# Altium schematic sheet Isolated Power.SchDoc
size A
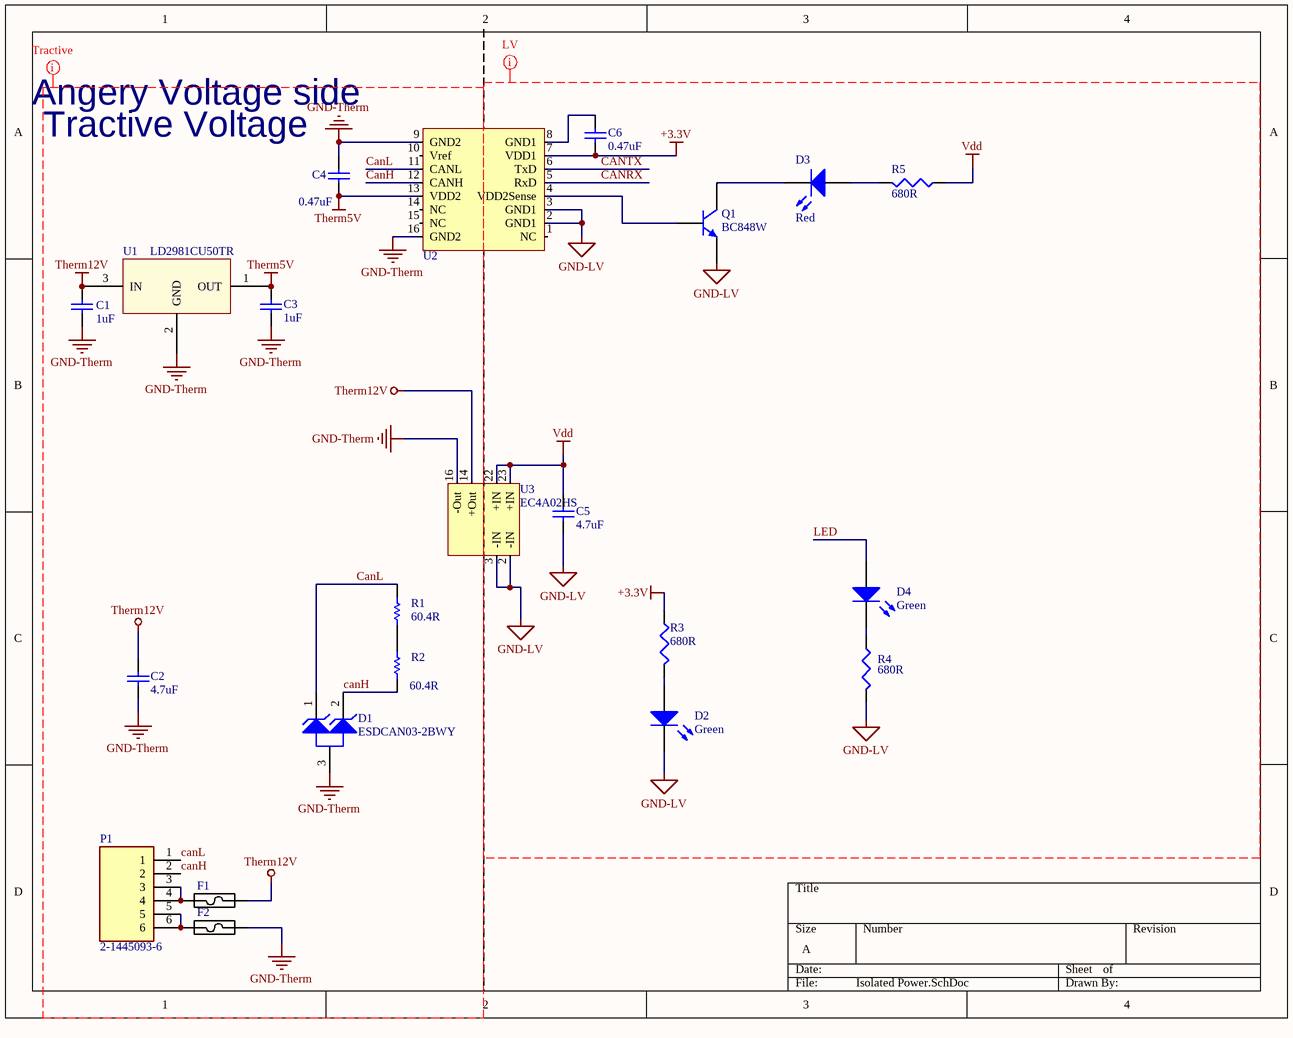
[diagram p0: Isolated Power.SchDoc]

## Parts
C1  value 1uF  [CAPC1608X95N]  (hidden comment: Cap)
C2  value 4.7uF  [CAPC1608X95N]  (hidden comment: Cap)
C3  value 1uF  [CAPC1608X95N]  (hidden comment: NP0)
C4  value 0.47uF  [CAPC1608X95N]  (hidden comment: NP0)
C5  value 4.7uF  [CAPC1608X95N]  (hidden comment: Cap)
C6  value 0.47uF  [CAPC1608X95N]  (hidden comment: NP0)
D1  ESDCAN03-2BWY  [SOT65P210X110-3N]
D2  Green  [0805_A]
D3  Red  [0805_A]
D4  Green  [0805_A]
F1  FUSE-GENERIC  [HF461 Fuse]  (value not drawn)
F2  FUSE-GENERIC  [HF461 Fuse]  (value not drawn)
P1  2-1445093-6  [214450936]
Q1  BC848W  [SOT323_N]
R1  value 60.4R  [RESC1608X55N]  (hidden comment: Res1)
R2  value 60.4R  [RESC1608X55N]  (hidden comment: Res1)
R3  value 680R  [RESC1608X55N]  (hidden comment: Res3)
R4  680R  [RESC1608X55N]
R5  value 680R  [RESC1608X55N]  (hidden comment: Res3)
U1  LD2981CU50TR  [SOT89N]
U2  ADM3054  [SOIC-OE16_L]  (value not drawn)
U3  EC4A02HS  [EC4A]

## Nets
+3.3V: C6.1 R3.1 U2.7(VDD1)
GND-LV: C5.2 D2.1(K) Q1.2(E) R4.2 U2.2(GND1) U2.3(GND1) U3.2(-IN) U3.3(-IN)
GND-Therm: C1.1 C2.2 C3.2 C4.2 D1.3(A) F2.2 U1.2(GND) U2.9(GND2) U2.16(GND2) U3.16(-Out)
Therm5V: C3.1 C4.1 U1.1(OUT) U2.13(VDD2)
Therm12V: C1.2 C2.1 F1.2 U1.3(IN) U3.14(+Out)
Vdd: C5.1 R5.1 U3.22(+IN) U3.23(+IN)
canH: D1.2(K2) P1.2 R2.1 U2.12(CANH)
CanL: D1.1(K1) P1.1 R1.2 U2.11(CANL)
CANRX: U2.5(RxD)
CANTX: U2.6(TxD)
LED: D4.2(A)
NetC6_2: C6.2 U2.8(GND1)
NetD2_2: D2.2(A) R3.2
NetD3_1: D3.1(K) Q1.3(C)
NetD3_2: D3.2(A) R5.2
NetD4_1: D4.1(K) R4.1
NetF1_1: F1.1 P1.3 P1.4
NetF2_1: F2.1 P1.5 P1.6
NetQ1_1: Q1.1(B) U2.4(VDD2Sense)
NetR1_1: R1.1 R2.2

Not connected (* = marked no-connect by the designer): U2 1(NC) 10(Vref) 14(NC) 15(NC)

## Layout directives
net class Tractive: CanH, canH, canL, CanL, GND-Therm, Therm5V, Therm12V
net class LV: +3.3V, CANRX, CANTX, GND-LV, LED, Vdd

## Notes on the sheet
- Angery Voltage side
- (near C4) Tractive Voltage

## Library data of the parts
C1 = Cap: 264-4630; Published: 8-Jun-2000; LatestRevisionDate: 17-Jul-2002; LatestRevisionNote: Re-released for DXP Platform.; PackageReference: RAD-0.3; Publisher: Altium Limited; PackageDescription: Radial Cap, Thru-Hole; 2 Leads; 0.3 in Pin Spacing
C2 C5 = Cap: 691-1228; Published: 8-Jun-2000; LatestRevisionDate: 17-Jul-2002; LatestRevisionNote: Re-released for DXP Platform.; PackageReference: RAD-0.3; Publisher: Altium Limited; PackageDescription: Radial Cap, Thru-Hole; 2 Leads; 0.3 in Pin Spacing
C3 C4 C6 = Cap: 884-7175; Published: 8-Jun-2000; LatestRevisionDate: 17-Jul-2002; LatestRevisionNote: Re-released for DXP Platform.; PackageReference: RAD-0.3; Publisher: Altium Limited; PackageDescription: Radial Cap, Thru-Hole; 2 Leads; 0.3 in Pin Spacing
D1 = NZL5V6ATT1: 124-1110; Manufacturer: On Semiconductor; Direction: Unidirectional; IR Max (uA): 1; Packing: Tape and Reel; V(BR) Typ (V): 5.6; DatasheetVersion: Rev. 3; PackageVersion: Rev. F, 07/2005; PackageReference: SC-75-3-463-01; PackageDescription: 3-Pin Small Outline Transistor, Body 1.6 x 0.8 mm, Pitch 0.5 mm; Supplier 1: Digi-Key; Supplier Part Number 1: NZL5V6ATT1OS-ND; Mounting Technology: Surface Mount; PartNumber: NZL5V6ATT1; ComponentLink1Description: Manufacturer URL; ComponentLink1URL: http://www.onsemi.com/; ComponentLink2Description: Datasheet; ComponentLink2URL: http://www.onsemi.com/pub_link/Collateral/NZL5V6ATT1-D.PDF; ComponentLink3Description: Package Specification; ComponentLink3URL: http://www.onsemi.com/pub_link/Collateral/463-01.PDF
D2-D4 = CMP-1426-00010-1: SMD mono-color Chip LED, WL-SMCW, Super Red; Manufacturer: Wuerth Elektronik; PartNumber: 150080SS75000; PackageReference: 0805_A; ComponentLink2URL: http://katalog.we-online.com/led/datasheet/150080SS75000.pdf; ComponentLink1URL: http://www.we-online.com; Color: Super Red; ComponentLink2Description: Datasheet; ComponentLink1Description: Manufacturer URL
F1 F2 = FUSE-GENERIC: 738-2970 / 0461.500ER
P1 = 2-1445093-6: Connector; Manufacturer_Name: TE Connectivity; Datasheet Link: https://www.te.com/commerce/DocumentDelivery/DDEController?Action=srchrtrv&DocNm=1445093&DocType=Customer+Drawing&DocLang=English; Height: 9.24mm; Manufacturer_Part_Number: 2-1445093-6
Q1 = BC848W: NPN General-purpose Transistor; Published: 17-Sep-2003; LatestRevisionDate: 12-Dec-2006; LatestRevisionNote: IPC-7351 Footprint Added.; DatasheetVersion: 4-Feb-2002; PackageVersion: Apr-1999; PackageReference: SOT323; Publisher: Altium Limited; PackageDescription: 3-Pin SOT-323 Package 0.65 mm Pitch, 2.1 mm Lead Span; ComponentLink1Description: Manufacturer Link; ComponentLink1URL: http://www.semiconductors.philips.com/; ComponentLink2Description: Datasheet; ComponentLink2URL: http://www.semiconductors.philips.com/acrobat/datasheets/BC846W_BC847W_BC848W_4.pdf
R1 R2 = Res1: 679-1597; Published: 8-Jun-2000; LatestRevisionDate: 17-Jul-2002; LatestRevisionNote: Re-released for DXP Platform.; PackageReference: AXIAL-0.3; Publisher: Altium Limited; PackageDescription: Axial Device, Thru-Hole; 2 Leads; 0.3 in Pin Spacing
R3-R5 = Res3: 117-880; Published: 8-Jun-2000; LatestRevisionDate: 29-May-2009; LatestRevisionNote: IPC-7351 Footprint Added.; PackageReference: J1-0603; Publisher: Altium Limited; PackageDescription: Chip Resistor
  R4: Value: 680R
U1 = LDK220U33R: 5V LDO 100mA / LD2981CU50TR; Manufacturer: ST Microelectrics; Suppl. Link/No.: 511-LDK220U33R; Supplier: Mouser; Value: -; Notes: -; Mfg No.: LDK220U33R